# Altium schematic sheet IR-sensors.SchDoc: Thymio2
size A3; Organization: Original design LSRO-STI-EPFL; Address1: Association Mobsya; Address2: Michael Bonani; Address3: Ch. Closel 3; Address4: CH-1020 Renens; DocumentNumber: 4; Revision: 2.3; SheetNumber: 4; SheetTotal: 9; Engineer: Michael Bonani; Title2: PCB principal; ProjectName: Project Name
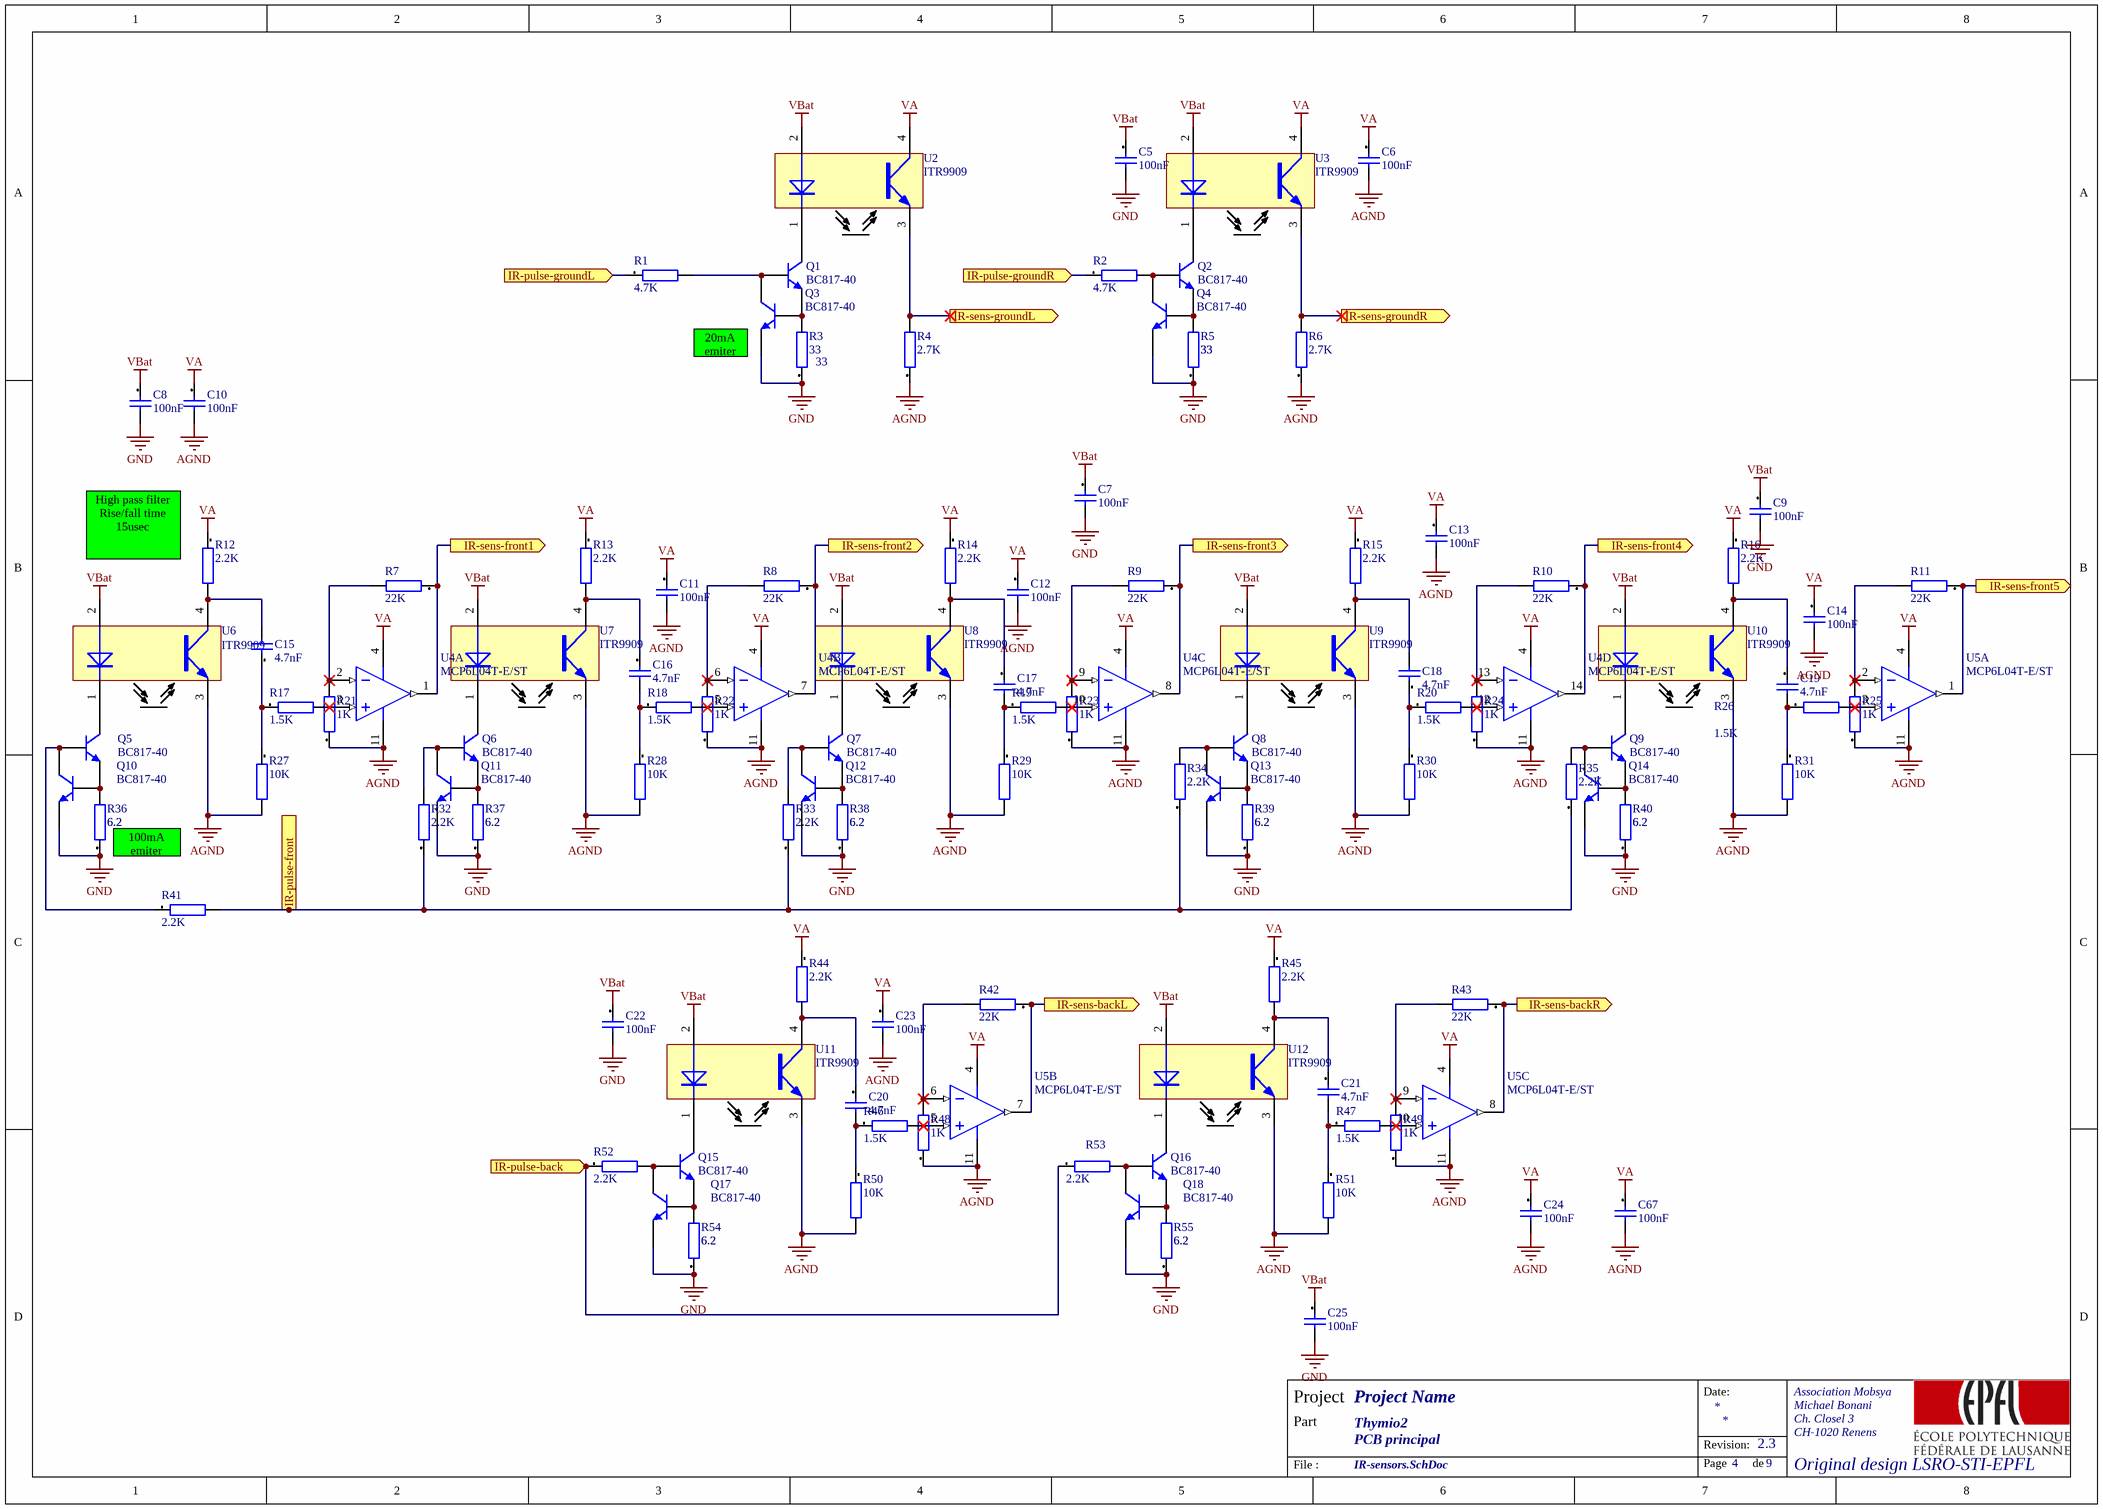
[diagram p0: IR-sensors.SchDoc]

## Parts
C5  100nF  [CAPC1005X05N]
C6  100nF  [CAPC1005X05N]
C7  100nF  [CAPC1005X05N]
C8  100nF  [CAPC1005X05N]
C9  100nF  [CAPC1005X05N]
C10  100nF  [CAPC1005X05N]
C11  100nF  [CAPC1005X05N]
C12  100nF  [CAPC1005X05N]
C13  100nF  [CAPC1005X05N]
C14  100nF  [CAPC1005X05N]
C15  4.7nF  [CAPC1005X05N]
C16  4.7nF  [CAPC1005X05N]
C17  4.7nF  [CAPC1005X05N]
C18  4.7nF  [CAPC1005X05N]
C19  4.7nF  [CAPC1005X05N]
C20  4.7nF  [CAPC1005X05N]
C21  4.7nF  [CAPC1005X05N]
C22  100nF  [CAPC1005X05N]
C23  100nF  [CAPC1005X05N]
C24  100nF  [CAPC1005X05N]
C25  100nF  [CAPC1005X05N]
C67  100nF  [CAPC1005X05N]
Q1  BC817-40  [SOT23_N]
Q2  BC817-40  [SOT23_N]
Q3  BC817-40  [SOT23_N]
Q4  BC817-40  [SOT23_N]
Q5  BC817-40  [SOT23_N]
Q6  BC817-40  [SOT23_N]
Q7  BC817-40  [SOT23_N]
Q8  BC817-40  [SOT23_N]
Q9  BC817-40  [SOT23_N]
Q10  BC817-40  [SOT23_N]
Q11  BC817-40  [SOT23_N]
Q12  BC817-40  [SOT23_N]
Q13  BC817-40  [SOT23_N]
Q14  BC817-40  [SOT23_N]
Q15  BC817-40  [SOT23_N]
Q16  BC817-40  [SOT23_N]
Q17  BC817-40  [SOT23_N]
Q18  BC817-40  [SOT23_N]
R1  4.7K  [RESC1005X04N]
R2  4.7K  [RESC1005X04N]
R3  33  [RESC1005X04N]
R4  2.7K  [RESC1005X04N]
R5  33  [RESC1005X04N]
R6  2.7K  [RESC1005X04N]
R7  22K  [RESC1005X04N]
R8  22K  [RESC1005X04N]
R9  22K  [RESC1005X04N]
R10  22K  [RESC1005X04N]
R11  22K  [RESC1005X04N]
R12  2.2K  [RESC1005X04N]
R13  2.2K  [RESC1005X04N]
R14  2.2K  [RESC1005X04N]
R15  2.2K  [RESC1005X04N]
R16  2.2K  [RESC1005X04N]
R17  1.5K  [RESC1005X04N]
R18  1.5K  [RESC1005X04N]
R19  1.5K  [RESC1005X04N]
R20  1.5K  [RESC1005X04N]
R21  1K  [RESC1005X04N]
R22  1K  [RESC1005X04N]
R23  1K  [RESC1005X04N]
R24  1K  [RESC1005X04N]
R25  1K  [RESC1005X04N]
R26  1.5K  [RESC1005X04N]
R27  10K  [RESC1005X04N]
R28  10K  [RESC1005X04N]
R29  10K  [RESC1005X04N]
R30  10K  [RESC1005X04N]
R31  10K  [RESC1005X04N]
R32  2.2K  [RESC1005X04N]
R33  2.2K  [RESC1005X04N]
R34  2.2K  [RESC1005X04N]
R35  2.2K  [RESC1005X04N]
R36  6.2  [RESC1005X04N]
R37  6.2  [RESC1005X04N]
R38  6.2  [RESC1005X04N]
R39  6.2  [RESC1005X04N]
R40  6.2  [RESC1005X04N]
R41  2.2K  [RESC1005X04N]
R42  22K  [RESC1005X04N]
R43  22K  [RESC1005X04N]
R44  2.2K  [RESC1005X04N]
R45  2.2K  [RESC1005X04N]
R46  1.5K  [RESC1005X04N]
R47  1.5K  [RESC1005X04N]
R48  1K  [RESC1005X04N]
R49  1K  [RESC1005X04N]
R50  10K  [RESC1005X04N]
R51  10K  [RESC1005X04N]
R52  2.2K  [RESC1005X04N]
R53  2.2K  [RESC1005X04N]
R54  6.2  [RESC1005X04N]
R55  6.2  [RESC1005X04N]
U2  ITR9909  [ITR9909_LONG]
U3  ITR9909  [ITR9909_LONG]
U4  MCP6L04T-E/ST  [TSSOP-ST14_N]  (parts A,B,C,D of 4)
U5  MCP6L04T-E/ST  [TSSOP-ST14_N]  (parts A,B,C of 4)
U6  ITR9909  [ITR9909_EDGE]
U7  ITR9909  [ITR9909_EDGE]
U8  ITR9909  [ITR9909_EDGE]
U9  ITR9909  [ITR9909_EDGE]
U10  ITR9909  [ITR9909_EDGE]
U11  ITR9909  [ITR9909_EDGE]
U12  ITR9909  [ITR9909_EDGE]

## Ports
IR-pulse-back (in), IR-pulse-front (in), IR-pulse-groundL (in), IR-pulse-groundR (in), IR-sens-backL (out), IR-sens-backR (out), IR-sens-front1 (out), IR-sens-front2 (out), IR-sens-front3 (out), IR-sens-front4 (out), IR-sens-front5 (out), IR-sens-groundL (out), IR-sens-groundR (out)

## Nets
AGND: C6.2 C10.2 C11.2 C12.2 C13.2 C14.2 C23.2 C24.2 C67.2 R4.1 R6.1 R21.1 R22.1 R23.1 R24.1 R25.1 R27.2 R28.2 R29.2 R30.2 R31.2 R48.1 R49.1 R50.2 R51.2 U4.11(VSS) U5.11(VSS) U6.3(E) U7.3(E) U8.3(E) U9.3(E) U10.3(E) U11.3(E) U12.3(E)
GND: C5.2 C7.2 C8.2 C9.2 C22.2 C25.2 Q3.2(E) Q4.2(E) Q10.2(E) Q11.2(E) Q12.2(E) Q13.2(E) Q14.2(E) Q17.2(E) Q18.2(E) R3.1 R5.1 R36.1 R37.1 R38.1 R39.1 R40.1 R54.1 R55.1
VA: C6.1 C10.1 C11.1 C12.1 C13.1 C14.1 C23.1 C24.1 C67.1 R12.1 R13.1 R14.1 R15.1 R16.1 R44.1 R45.1 U2.4(C) U3.4(C) U4.4(VDD) U5.4(VDD)
VBat: C5.1 C7.1 C8.1 C9.1 C22.1 C25.1 U2.2(A) U3.2(A) U6.2(A) U7.2(A) U8.2(A) U9.2(A) U10.2(A) U11.2(A) U12.2(A)
IR-pulse-back: R52.1 R53.1 ; port IR-pulse-back
IR-pulse-front: R32.1 R33.1 R34.1 R35.1 R41.2 ; port IR-pulse-front
IR-pulse-groundL: R1.1 ; port IR-pulse-groundL
IR-pulse-groundR: R2.1 ; port IR-pulse-groundR
IR-sens-backL: R42.1 U5.7(VOUTB) ; port IR-sens-backL
IR-sens-backR: R43.1 U5.8(VOUTC) ; port IR-sens-backR
IR-sens-front1: R7.1 U4.1(VOUTA) ; port IR-sens-front1
IR-sens-front2: R8.1 U4.7(VOUTB) ; port IR-sens-front2
IR-sens-front3: R9.1 U4.8(VOUTC) ; port IR-sens-front3
IR-sens-front4: R10.1 U4.14(VOUTD) ; port IR-sens-front4
IR-sens-front5: R11.1 U5.1(VOUTA) ; port IR-sens-front5
IR-sens-groundL: R4.2 U2.3(E) ; port IR-sens-groundL
IR-sens-groundR: R6.2 U3.3(E) ; port IR-sens-groundR
NetC15_1: C15.1 R17.1 R27.1
NetC15_2: C15.2 R12.2 U6.4(C)
NetC16_1: C16.1 R13.2 U7.4(C)
NetC16_2: C16.2 R18.1 R28.1
NetC17_1: C17.1 R14.2 U8.4(C)
NetC17_2: C17.2 R19.1 R29.1
NetC18_1: C18.1 R20.1 R30.1
NetC18_2: C18.2 R15.2 U9.4(C)
NetC19_1: C19.1 R16.2 U10.4(C)
NetC19_2: C19.2 R26.1 R31.1
NetC20_1: C20.1 R44.2 U11.4(C)
NetC20_2: C20.2 R46.1 R50.1
NetC21_1: C21.1 R45.2 U12.4(C)
NetC21_2: C21.2 R47.1 R51.1
NetQ1_1: Q1.1(B) Q3.3(C) R1.2
NetQ1_2: Q1.2(E) Q3.1(B) R3.2
NetQ1_3: Q1.3(C) U2.1(C)
NetQ2_1: Q2.1(B) Q4.3(C) R2.2
NetQ2_2: Q2.2(E) Q4.1(B) R5.2
NetQ2_3: Q2.3(C) U3.1(C)
NetQ5_1: Q5.1(B) Q10.3(C) R41.1
NetQ5_2: Q5.2(E) Q10.1(B) R36.2
NetQ5_3: Q5.3(C) U6.1(C)
NetQ6_1: Q6.1(B) Q11.3(C) R32.2
NetQ6_2: Q6.2(E) Q11.1(B) R37.2
NetQ6_3: Q6.3(C) U7.1(C)
NetQ7_1: Q7.1(B) Q12.3(C) R33.2
NetQ7_2: Q7.2(E) Q12.1(B) R38.2
NetQ7_3: Q7.3(C) U8.1(C)
NetQ8_1: Q8.1(B) Q13.3(C) R34.2
NetQ8_2: Q8.2(E) Q13.1(B) R39.2
NetQ8_3: Q8.3(C) U9.1(C)
NetQ9_1: Q9.1(B) Q14.3(C) R35.2
NetQ9_2: Q9.2(E) Q14.1(B) R40.2
NetQ9_3: Q9.3(C) U10.1(C)
NetQ15_1: Q15.1(B) Q17.3(C) R52.2
NetQ15_2: Q15.2(E) Q17.1(B) R54.2
NetQ15_3: Q15.3(C) U11.1(C)
NetQ16_1: Q16.1(B) Q18.3(C) R53.2
NetQ16_2: Q16.2(E) Q18.1(B) R55.2
NetQ16_3: Q16.3(C) U12.1(C)
NetR7_2: R7.2 R21.2 U4.2(VINA-)
NetR8_2: R8.2 R22.2 U4.6(VINB-)
NetR9_2: R9.2 R23.2 U4.9(VINC-)
NetR10_2: R10.2 R24.2 U4.13(VIND-)
NetR11_2: R11.2 R25.2 U5.2(VINA-)
NetR17_2: R17.2 U4.3(VINA+)
NetR18_2: R18.2 U4.5(VINB+)
NetR19_2: R19.2 U4.10(VINC+)
NetR20_2: R20.2 U4.12(VIND+)
NetR26_2: R26.2 U5.3(VINA+)
NetR42_2: R42.2 R48.2 U5.6(VINB-)
NetR43_2: R43.2 R49.2 U5.9(VINC-)
NetR46_2: R46.2 U5.5(VINB+)
NetR47_2: R47.2 U5.10(VINC+)

## Notes on the sheet
- (near Q3) 20mA emiter
- (near R12) High pass filter
  Rise/fall time 15usec
- (near R36) 100mA emiter
- Date:
- Project
- Part
- Revision:
- File :
- Page
- de

## Library data of the parts
C5 C7-C9 C14 C22 C25 = 100nF[[/\]]0603[[/\]]1: Capacitor; Manufacturer: Kemet; Manufacturer Nr: C0603C104K5RAC; Preference: 1; Tolerance +: +10; Tolerance -: -10; Dielectric: X7R; Voltage: 50; MaxTemperature: +125; MinTemperature: -55; Quant_1: 10; Quant_2: 100; Quant_3: 1000; Quant_4: 4000; Currentie: CHF; Size: 0603; Footprint Acort: 0603_G; Supplier: Farnell; Supplier Nr: 1288255; ComponentLink2Description: Farnell link; ComponentLink2URL: http://ch.farnell.com/jsp/displayProduct.jsp?sku=1288255; Price_1: 0.046; Price_2: 0.04; Price_3: 0.037; Price_4: 0.036; ROHS: True; DateLastUpdate: 2007-12-03 / 14:22:31
C6 C10-C13 C23 C24 C67 = 100nF[[/\]]0603[[/\]]1: Capacitor; Manufacturer: Kemet; Manufacturer Nr: C0603C104K5RAC; Preference: 1; Tolerance +: +10; Tolerance -: -10; Dielectric: X7R; Voltage: 50; MaxTemperature: +125; MinTemperature: -55; Quant_1: 10; Quant_2: 100; Quant_3: 1000; Quant_4: 4000; Currentie: CHF; LayerSch: Top; Size: 0603; Footprint Acort: 0603_G; Supplier: Farnell; Supplier Nr: 1288255; ComponentLink2Description: Farnell link; ComponentLink2URL: http://ch.farnell.com/jsp/displayProduct.jsp?sku=1288255; Price_1: 0.046; Price_2: 0.04; Price_3: 0.037; Price_4: 0.036; ROHS: True; DateLastUpdate: 2007-12-03 / 14:22:31
C15-C21 = CAP-NP: Capacitor
Q1-Q4 Q7 Q12 = BC817-40: NPN General-purpose Transistor; Published: 17-Sep-2003; LatestRevisionDate: 12-Dec-2006; LatestRevisionNote: IPC-7351 Footprint Added.; DatasheetVersion: Jun-1999; PackageVersion: May-1999; PackageReference: SOT23; Publisher: Altium Limited; PackageDescription: 3-Pin SOT-23 Package 0.95 mm Pitch, 2.3 mm Lead Span; ComponentLink1Description: Manufacturer Link; ComponentLink1URL: http://www.semiconductors.philips.com/; ComponentLink2Description: Datasheet; ComponentLink2URL: http://www.semiconductors.philips.com/acrobat/datasheets/BC817_BC817W_BC337_5.pdf
Q5 Q6 Q8-Q11 Q13-Q18 = BC817-40: NPN General-purpose Transistor; LayerSch: Top; Published: 17-Sep-2003; LatestRevisionDate: 12-Dec-2006; LatestRevisionNote: IPC-7351 Footprint Added.; DatasheetVersion: Jun-1999; PackageVersion: May-1999; PackageReference: SOT23; Publisher: Altium Limited; PackageDescription: 3-Pin SOT-23 Package 0.95 mm Pitch, 2.3 mm Lead Span; ComponentLink1Description: Manufacturer Link; ComponentLink1URL: http://www.semiconductors.philips.com/; ComponentLink2Description: Datasheet; ComponentLink2URL: http://www.semiconductors.philips.com/acrobat/datasheets/BC817_BC817W_BC337_5.pdf
R1 R2 = 4.7K[[/\]]0603[[/\]]1: Resistor; Manufacturer: Vishay; Manufacturer Nr: D11CRCW06030B4701F; Tolerance: +/-1; Preference: 1; Power: 0.1; Voltage: 75; Current: 1.5; ppm/K: +/-100; Quant_1: 10; Quant_2: 100; Quant_3: 500; Currentie: CHF; Size: 0603; Footprint Acort: 0603; Supplier: Distrelec; Supplier Nr: 715604; ComponentLink2Description: Distrelec link; ComponentLink2URL: http://www.distrelec.com/ishopWebFront/search/luceneSearch.do?dispatch=find&showImage=on&artnrPhrase=715604; ROHS: True; Price_1: 0.0538; Price_2: 0.0323; Price_3: 0.0204; DateLastUpdate: 2007-12-03 / 16:30:20
R3 R7-R10 R12-R24 R27-R31 R38 R44 R45 R50 R51 = RES: 120
  R3: Value: 33
  R7-R10: Value: 22k
  R12-R16 R44 R45: Value: 2.2k
  R17-R20: Value: 1.5k
  R21-R24: Value: 1k
  R27-R31 R50 R51: Value: 10k
  R38: Value: 6.2
R4 R6 = RES: Resistor; Value: 1k
R5 = RES: Resistor; Value: 33
R11 R25 R26 R36 R37 R39 R40 R42 R43 R46-R49 R54 R55 = RES: 120; LayerSch: Top
  R11 R42 R43: Value: 22k
  R25 R48 R49: Value: 1k
  R26 R46 R47: Value: 1.5k
  R36 R37 R39 R40 R54 R55: Value: 6.2
R32 R34 R35 R41 R52 R53 = 2.2K[[/\]]0603[[/\]]1: Resistor; Manufacturer: Vishay; Manufacturer Nr: D11CRCW06030B2201F; Tolerance: +/-1; Preference: 1; Power: 0.1; Voltage: 75; Current: 1.5; ppm/K: +/-100; Quant_1: 10; Quant_2: 100; Quant_3: 500; Currentie: CHF; LayerSch: Top; Size: 0603; Footprint Acort: 0603; Supplier: Distrelec; Supplier Nr: 715596; ComponentLink2Description: Distrelec link; ComponentLink2URL: http://www.distrelec.com/ishopWebFront/search/luceneSearch.do?dispatch=find&showImage=on&artnrPhrase=715596; ROHS: True; Price_1: 0.085; Price_2: 0.0603; Price_3: 0.0247; DateLastUpdate: 2009-06-10 / 12:36:43
R33 = 2.2K[[/\]]0603[[/\]]1: Resistor; Manufacturer: Vishay; Manufacturer Nr: D11CRCW06030B2201F; Tolerance: +/-1; Preference: 1; Power: 0.1; Voltage: 75; Current: 1.5; ppm/K: +/-100; Quant_1: 10; Quant_2: 100; Quant_3: 500; Currentie: CHF; Size: 0603; Footprint Acort: 0603; Supplier: Distrelec; Supplier Nr: 715596; ComponentLink2Description: Distrelec link; ComponentLink2URL: http://www.distrelec.com/ishopWebFront/search/luceneSearch.do?dispatch=find&showImage=on&artnrPhrase=715596; ROHS: True; Price_1: 0.085; Price_2: 0.0603; Price_3: 0.0247; DateLastUpdate: 2009-06-10 / 12:36:43
U2 U3 = ITR9909: Everlight Opto Interrupter
U4 = MCP6L04T-E/ST: 1 MHz, 85 µA Quad Op Amp, 14-Pin TSSOP, Extended Temperature Range, Tape and Reel; FirstPublished: 2-Dec-2009; DatasheetVersion: revA, Mar-2009; PackageVersion: revBB, Aug-2009; PackageReference: TSSOP-ST14; Publisher: Altium Limited; PackageDescription: 14-Lead Plastic Thin Shrink Small Outline (ST) - 4.4mm Body [TSSOP]; Supplier 1: Digi-Key; Supplier Part Number 1: MCP6L04T-E/STTR-ND; Supplier 2: Digi-Key; Supplier Part Number 2: MCP6L04T-E/STDKR-ND; Supplier 3: Digi-Key; Supplier Part Number 3: MCP6L04T-E/STCT-ND; Supplier 4: Newark; Supplier Part Number 4: 08R1815; ComponentLink1Description: Datasheet; ComponentLink1URL: http://ww1.microchip.com/downloads/en/DeviceDoc/22140a.pdf; ComponentLink2Description: Packaging Specification; ComponentLink2URL: http://www.microchip.com/stellent/groups/techpub_sg/documents/packagingspec/en012702.pdf; ComponentLink3Description: Microchip.com Home; ComponentLink3URL: http://www.microchip.com/
U5 = MCP6L04T-E/ST: 1 MHz, 85 µA Quad Op Amp, 14-Pin TSSOP, Extended Temperature Range, Tape and Reel; LayerSch: Top; FirstPublished: 2-Dec-2009; DatasheetVersion: revA, Mar-2009; PackageVersion: revBB, Aug-2009; PackageReference: TSSOP-ST14; Publisher: Altium Limited; PackageDescription: 14-Lead Plastic Thin Shrink Small Outline (ST) - 4.4mm Body [TSSOP]; Supplier 1: Digi-Key; Supplier Part Number 1: MCP6L04T-E/STTR-ND; Supplier 2: Digi-Key; Supplier Part Number 2: MCP6L04T-E/STDKR-ND; Supplier 3: Digi-Key; Supplier Part Number 3: MCP6L04T-E/STCT-ND; Supplier 4: Newark; Supplier Part Number 4: 08R1815; ComponentLink1Description: Datasheet; ComponentLink1URL: http://ww1.microchip.com/downloads/en/DeviceDoc/22140a.pdf; ComponentLink2Description: Packaging Specification; ComponentLink2URL: http://www.microchip.com/stellent/groups/techpub_sg/documents/packagingspec/en012702.pdf; ComponentLink3Description: Microchip.com Home; ComponentLink3URL: http://www.microchip.com/
U6-U12 = ITR9909: Everlight Opto Interrupter; LayerSch: Top